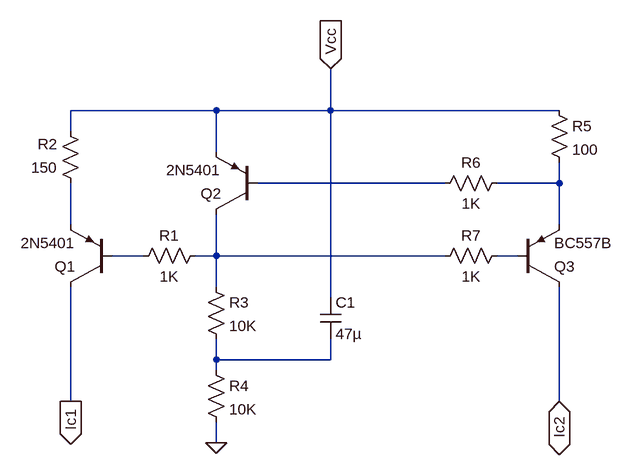
[diagram p0: schematic current_source.asc]
current_source.asc, the LTspice schematic file:
Version 4
SHEET 1 1204 680
WIRE 336 -80 112 -80
WIRE 512 -80 512 -144
WIRE 512 -80 336 -80
WIRE 864 -80 512 -80
WIRE 112 -48 112 -80
WIRE 336 -16 336 -80
WIRE 688 32 400 32
WIRE 864 32 864 0
WIRE 864 32 768 32
WIRE 112 96 112 32
WIRE 864 96 864 32
WIRE 224 144 176 144
WIRE 336 144 336 80
WIRE 336 144 304 144
WIRE 688 144 336 144
WIRE 800 144 768 144
WIRE 336 192 336 144
WIRE 512 208 512 -80
WIRE 336 304 336 272
WIRE 512 304 512 272
WIRE 512 304 336 304
WIRE 336 320 336 304
WIRE 112 368 112 192
WIRE 864 368 864 192
WIRE 336 432 336 400
FLAG 336 432 0
FLAG 112 368 Ic1
IOPIN 112 368 Out
FLAG 864 368 Ic2
IOPIN 864 368 BiDir
FLAG 512 -144 Vcc
IOPIN 512 -144 In
SYMBOL pnp 176 192 R180
SYMATTR InstName Q1
SYMATTR Value 2N5401
SYMBOL pnp 400 80 R180
SYMATTR InstName Q2
SYMATTR Value 2N5401
SYMBOL res 320 128 R90
WINDOW 0 0 56 VBottom 2
WINDOW 3 32 56 VTop 2
SYMATTR InstName R1
SYMATTR Value 1K
SYMBOL res 128 48 R180
WINDOW 0 36 76 Left 2
WINDOW 3 36 40 Left 2
SYMATTR InstName R2
SYMATTR Value 150
SYMBOL res 320 176 R0
SYMATTR InstName R3
SYMATTR Value 10K
SYMBOL res 320 304 R0
SYMATTR InstName R4
SYMATTR Value 10K
SYMBOL res 848 -96 R0
SYMATTR InstName R5
SYMATTR Value 100
SYMBOL res 784 16 R90
WINDOW 0 0 56 VBottom 2
WINDOW 3 32 56 VTop 2
SYMATTR InstName R6
SYMATTR Value 1K
SYMBOL res 784 128 R90
WINDOW 0 0 56 VBottom 2
WINDOW 3 32 56 VTop 2
SYMATTR InstName R7
SYMATTR Value 1K
SYMBOL cap 496 208 R0
SYMATTR InstName C1
SYMATTR Value 47µ
SYMBOL pnp 800 192 M180
SYMATTR InstName Q3
SYMATTR Value BC557B

The netlist it stands for:
* current_source.asc
Q1 Ic1 N004 N003 0 2N5401
Q2 N005 N001 Vcc 0 2N5401
R1 N005 N004 1K
R2 N003 Vcc 150
R3 N005 N007 10K
R4 N007 0 10K
R5 Vcc N002 100
R6 N002 N001 1K
R7 N006 N005 1K
C1 Vcc N007 47µ
Q3 Ic2 N006 N002 0 BC557B
.model NPN NPN
.model PNP PNP
.lib standard.bjt
.backanno
.end